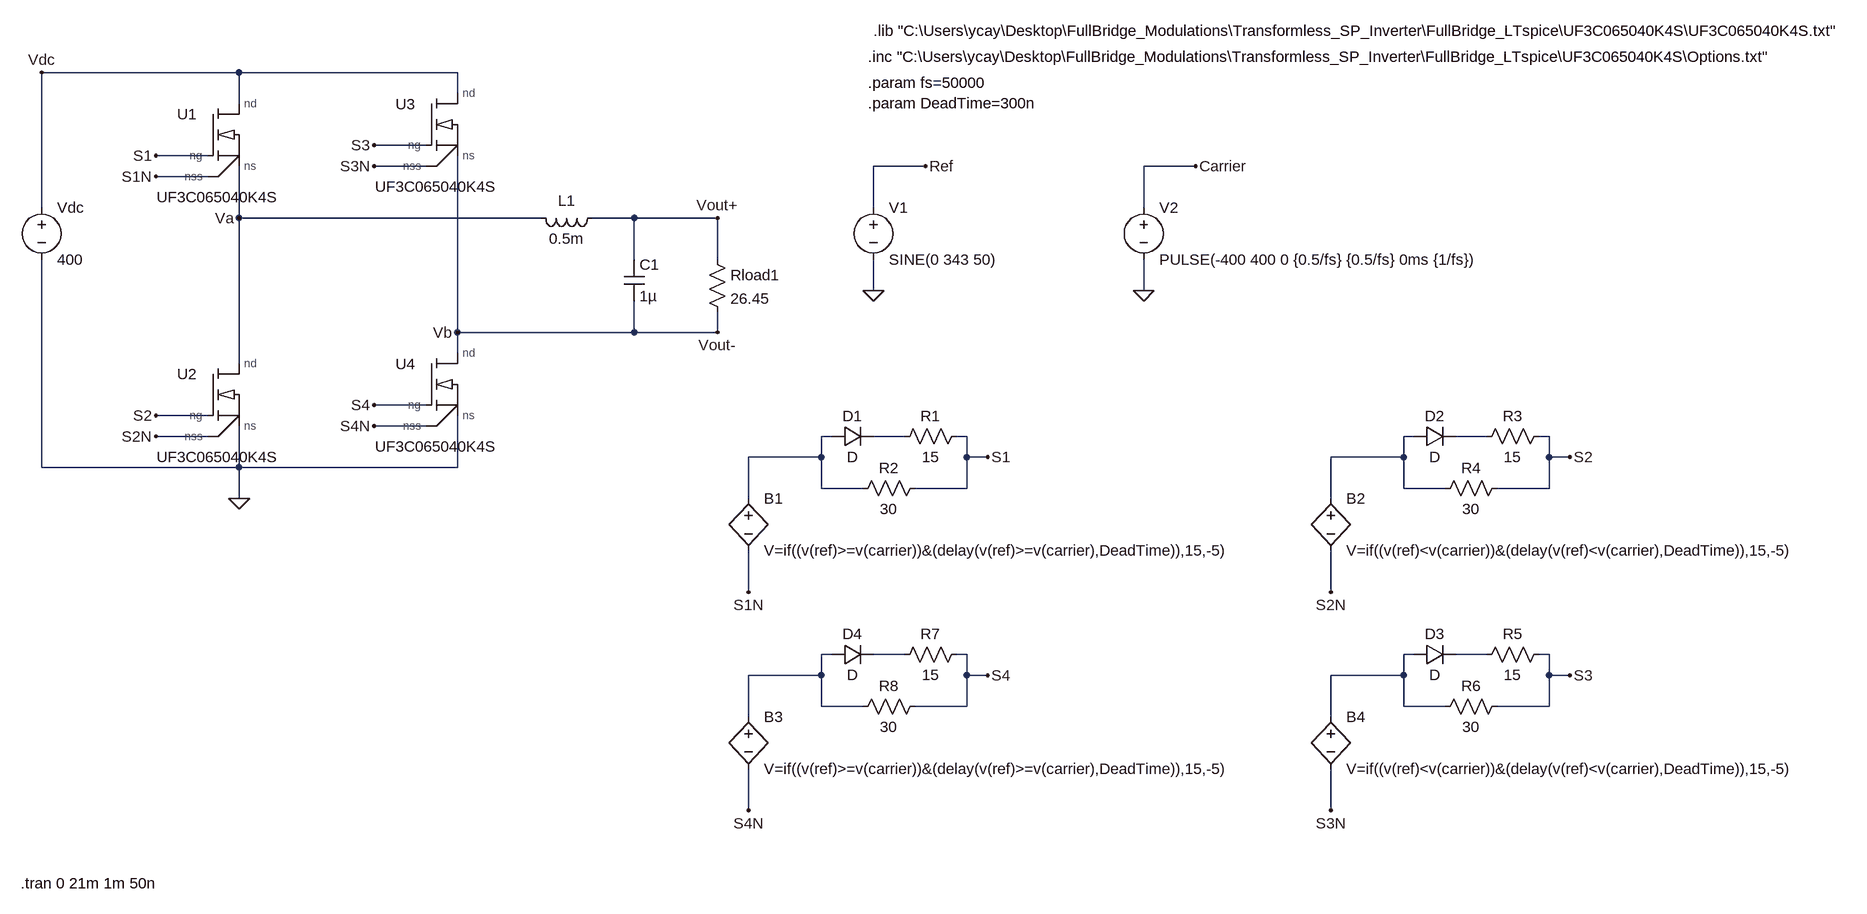
[diagram p0: schematic Bipolar_UF3C065040K4S_DeadTime.asc]
Bipolar_UF3C065040K4S_DeadTime.asc, the LTspice schematic file:
Version 4
SHEET 1 1412 752
WIRE -1216 -512 -1520 -512
WIRE -880 -512 -1216 -512
WIRE -880 -480 -880 -512
WIRE -1216 -464 -1216 -512
WIRE -928 -400 -1008 -400
WIRE -1264 -384 -1344 -384
WIRE -928 -368 -1008 -368
WIRE -160 -368 -240 -368
WIRE 256 -368 176 -368
WIRE -1264 -352 -1344 -352
WIRE -1520 -304 -1520 -512
WIRE -240 -304 -240 -368
WIRE 176 -304 176 -368
WIRE -1216 -288 -1216 -368
WIRE -752 -288 -1216 -288
WIRE -608 -288 -672 -288
WIRE -480 -288 -608 -288
WIRE -608 -224 -608 -288
WIRE -480 -224 -480 -288
WIRE -240 -176 -240 -224
WIRE 176 -176 176 -224
WIRE -880 -112 -880 -384
WIRE -608 -112 -608 -160
WIRE -608 -112 -880 -112
WIRE -480 -112 -480 -144
WIRE -480 -112 -608 -112
WIRE -880 -80 -880 -112
WIRE -1216 -64 -1216 -288
WIRE -928 0 -1008 0
WIRE -1264 16 -1344 16
WIRE -928 32 -1008 32
WIRE -1264 48 -1344 48
WIRE -304 48 -320 48
WIRE -192 48 -240 48
WIRE -96 48 -112 48
WIRE 592 48 576 48
WIRE 704 48 656 48
WIRE 800 48 784 48
WIRE -320 80 -320 48
WIRE -320 80 -432 80
WIRE -96 80 -96 48
WIRE -64 80 -96 80
WIRE 576 80 576 48
WIRE 576 80 464 80
WIRE 800 80 800 48
WIRE 832 80 800 80
WIRE -1520 96 -1520 -224
WIRE -1216 96 -1216 32
WIRE -1216 96 -1520 96
WIRE -880 96 -880 16
WIRE -880 96 -1216 96
WIRE -320 128 -320 80
WIRE -256 128 -320 128
WIRE -96 128 -96 80
WIRE -96 128 -176 128
WIRE 576 128 576 80
WIRE 640 128 576 128
WIRE 800 128 800 80
WIRE 800 128 720 128
WIRE -1216 144 -1216 96
WIRE -432 144 -432 80
WIRE 464 144 464 80
WIRE -432 288 -432 224
WIRE 464 288 464 224
WIRE -304 384 -320 384
WIRE -192 384 -240 384
WIRE -96 384 -112 384
WIRE 592 384 576 384
WIRE 704 384 656 384
WIRE 800 384 784 384
WIRE -320 416 -320 384
WIRE -320 416 -432 416
WIRE -96 416 -96 384
WIRE -64 416 -96 416
WIRE 576 416 576 384
WIRE 576 416 464 416
WIRE 800 416 800 384
WIRE 832 416 800 416
WIRE -320 464 -320 416
WIRE -256 464 -320 464
WIRE -96 464 -96 416
WIRE -96 464 -176 464
WIRE 576 464 576 416
WIRE 640 464 576 464
WIRE 800 464 800 416
WIRE 800 464 720 464
WIRE -432 480 -432 416
WIRE 464 480 464 416
WIRE -432 624 -432 560
WIRE 464 624 464 560
FLAG -240 -176 0
FLAG -160 -368 Ref
FLAG 176 -176 0
FLAG 256 -368 Carrier
FLAG -64 80 S1
FLAG 832 80 S2
FLAG -1216 144 0
FLAG -480 -288 Vout+
FLAG -480 -112 Vout-
FLAG -432 288 S1N
FLAG 464 288 S2N
FLAG -64 416 S4
FLAG -432 624 S4N
FLAG 832 416 S3
FLAG 464 624 S3N
FLAG -1344 -384 S1
FLAG -1344 -352 S1N
FLAG -1008 0 S4
FLAG -1008 32 S4N
FLAG -1344 16 S2
FLAG -1344 48 S2N
FLAG -1008 -400 S3
FLAG -1008 -368 S3N
FLAG -1520 -512 Vdc
FLAG -1216 -288 Va
FLAG -880 -112 Vb
SYMBOL voltage -240 -320 R0
WINDOW 123 0 0 Left 0
WINDOW 39 0 0 Left 0
SYMATTR InstName V1
SYMATTR Value SINE(0 343 50)
SYMBOL voltage 176 -320 R0
WINDOW 123 0 0 Left 0
WINDOW 39 0 0 Left 0
SYMATTR InstName V2
SYMATTR Value PULSE(-400 400 0 {0.5/fs} {0.5/fs} 0ms {1/fs})
SYMBOL bv -432 128 R0
SYMATTR InstName B1
SYMATTR Value V=if((v(ref)>=v(carrier))&(delay(v(ref)>=v(carrier),DeadTime)),15,-5)
SYMBOL bv 464 128 R0
SYMATTR InstName B2
SYMATTR Value V=if((v(ref)<v(carrier))&(delay(v(ref)<v(carrier),DeadTime)),15,-5)
SYMBOL ind -656 -304 R90
WINDOW 0 5 56 VBottom 2
WINDOW 3 32 56 VTop 2
SYMATTR InstName L1
SYMATTR Value 0.5m
SYMATTR SpiceLine Rser=30m
SYMBOL res -496 -240 R0
SYMATTR InstName Rload1
SYMATTR Value 26.45
SYMBOL voltage -1520 -320 R0
WINDOW 123 0 0 Left 0
WINDOW 39 0 0 Left 0
SYMATTR InstName Vdc
SYMATTR Value 400
SYMBOL cap -624 -224 R0
SYMATTR InstName C1
SYMATTR Value 1µ
SYMATTR SpiceLine Rser=0.11m
SYMBOL AutoGenerated\\UF3C065040K4S -1248 -416 R0
SYMATTR InstName U1
SYMBOL AutoGenerated\\UF3C065040K4S -1248 -16 R0
SYMATTR InstName U2
SYMBOL AutoGenerated\\UF3C065040K4S -912 -432 R0
SYMATTR InstName U3
SYMBOL AutoGenerated\\UF3C065040K4S -912 -32 R0
SYMATTR InstName U4
SYMBOL res -96 32 R90
WINDOW 0 0 56 VBottom 2
WINDOW 3 32 56 VTop 2
SYMATTR InstName R1
SYMATTR Value 15
SYMBOL diode -304 64 R270
WINDOW 0 32 32 VTop 2
WINDOW 3 0 32 VBottom 2
SYMATTR InstName D1
SYMBOL res -160 112 R90
WINDOW 0 0 56 VBottom 2
WINDOW 3 32 56 VTop 2
SYMATTR InstName R2
SYMATTR Value 30
SYMBOL bv -432 464 R0
SYMATTR InstName B3
SYMATTR Value V=if((v(ref)>=v(carrier))&(delay(v(ref)>=v(carrier),DeadTime)),15,-5)
SYMBOL bv 464 464 R0
SYMATTR InstName B4
SYMATTR Value V=if((v(ref)<v(carrier))&(delay(v(ref)<v(carrier),DeadTime)),15,-5)
SYMBOL res 800 32 R90
WINDOW 0 0 56 VBottom 2
WINDOW 3 32 56 VTop 2
SYMATTR InstName R3
SYMATTR Value 15
SYMBOL diode 592 64 R270
WINDOW 0 32 32 VTop 2
WINDOW 3 0 32 VBottom 2
SYMATTR InstName D2
SYMBOL res 736 112 R90
WINDOW 0 0 56 VBottom 2
WINDOW 3 32 56 VTop 2
SYMATTR InstName R4
SYMATTR Value 30
SYMBOL res 800 368 R90
WINDOW 0 0 56 VBottom 2
WINDOW 3 32 56 VTop 2
SYMATTR InstName R5
SYMATTR Value 15
SYMBOL diode 592 400 R270
WINDOW 0 32 32 VTop 2
WINDOW 3 0 32 VBottom 2
SYMATTR InstName D3
SYMBOL res 736 448 R90
WINDOW 0 0 56 VBottom 2
WINDOW 3 32 56 VTop 2
SYMATTR InstName R6
SYMATTR Value 30
SYMBOL res -96 368 R90
WINDOW 0 0 56 VBottom 2
WINDOW 3 32 56 VTop 2
SYMATTR InstName R7
SYMATTR Value 15
SYMBOL diode -304 400 R270
WINDOW 0 32 32 VTop 2
WINDOW 3 0 32 VBottom 2
SYMATTR InstName D4
SYMBOL res -160 448 R90
WINDOW 0 0 56 VBottom 2
WINDOW 3 32 56 VTop 2
SYMATTR InstName R8
SYMATTR Value 30
TEXT -248 -496 Left 2 !.param fs=50000\n.param DeadTime=300n
TEXT -1552 736 Left 2 !.tran 0 21m 1m 50n
TEXT -248 -536 Left 2 !.inc "C:\\Users\\ycay\\Desktop\\FullBridge_Modulations\\Transformless_SP_Inverter\\FullBridge_LTspice\\UF3C065040K4S\\Options.txt"
TEXT -240 -576 Left 2 !.lib "C:\\Users\\ycay\\Desktop\\FullBridge_Modulations\\Transformless_SP_Inverter\\FullBridge_LTspice\\UF3C065040K4S\\UF3C065040K4S.txt"

The netlist it stands for:
* Bipolar_UF3C065040K4S_DeadTime.asc
V1 Ref 0 SINE(0 343 50)
V2 Carrier 0 PULSE(-400 400 0 {0.5/fs} {0.5/fs} 0ms {1/fs})
B1 N001 S1N V=if((v(ref)>=v(carrier))&(delay(v(ref)>=v(carrier),DeadTime)),15,-5)
B2 N003 S2N V=if((v(ref)<v(carrier))&(delay(v(ref)<v(carrier),DeadTime)),15,-5)
L1 Vout+ Va 0.5m Rser=30m
Rload1 Vout+ Vb 26.45
Vdc Vdc 0 400
C1 Vout+ Vb 1µ Rser=0.11m
XU1 Vdc S1 Va S1N UF3C065040K4S  ; pins nd ng ns nss
XU2 Va S2 0 S2N UF3C065040K4S  ; pins nd ng ns nss
XU3 Vdc S3 Vb S3N UF3C065040K4S  ; pins nd ng ns nss
XU4 Vb S4 0 S4N UF3C065040K4S  ; pins nd ng ns nss
R1 S1 N002 15
D1 N001 N002 D
R2 S1 N001 30
B3 N005 S4N V=if((v(ref)>=v(carrier))&(delay(v(ref)>=v(carrier),DeadTime)),15,-5)
B4 N007 S3N V=if((v(ref)<v(carrier))&(delay(v(ref)<v(carrier),DeadTime)),15,-5)
R3 S2 N004 15
D2 N003 N004 D
R4 S2 N003 30
R5 S3 N008 15
D3 N007 N008 D
R6 S3 N007 30
R7 S4 N006 15
D4 N005 N006 D
R8 S4 N005 30
.model D D
.lib standard.dio
.param fs=50000
.param DeadTime=300n
.tran 0 21m 1m 50n
.inc "C:\Users\ycay\Desktop\FullBridge_Modulations\Transformless_SP_Inverter\FullBridge_LTspice\UF3C065040K4S\Options.txt"
.lib "C:\Users\ycay\Desktop\FullBridge_Modulations\Transformless_SP_Inverter\FullBridge_LTspice\UF3C065040K4S\UF3C065040K4S.txt"
.lib C:\Users\ycay\Desktop\FullBridge_Modulations\Transformless_SP_Inverter\FullBridge_LTspice\UF3C065040K4S\UF3C065040K4S.txt
.backanno
.end